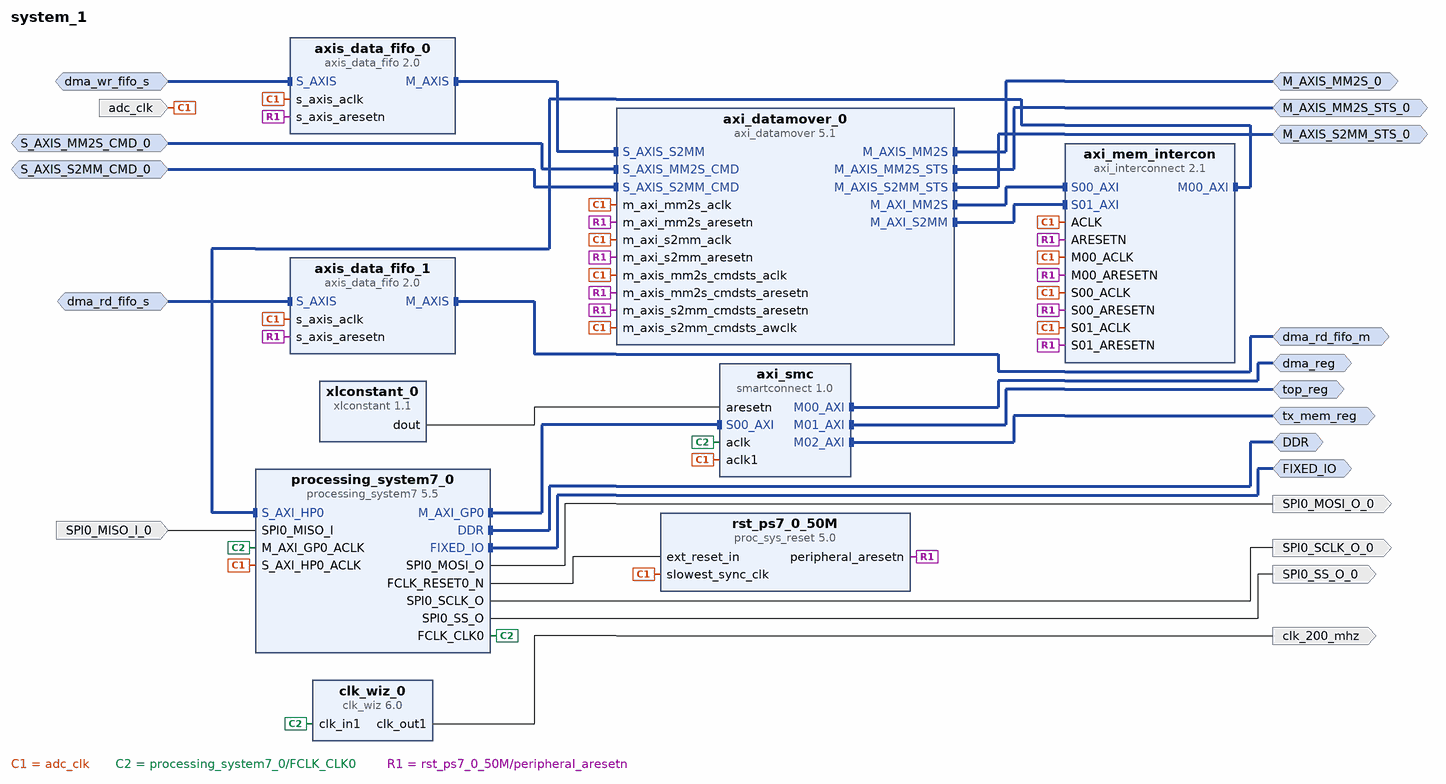
[diagram p0: block diagram of the top level]
# Vivado block design system_1, xc7z020clg400-2, Vivado 2024.2
create_bd_design system_1

create_bd_intf_port -mode Master -vlnv xilinx.com:interface:ddrx_rtl:1.0 DDR
create_bd_intf_port -mode Master -vlnv xilinx.com:display_processing_system7:fixedio_rtl:1.0 FIXED_IO
create_bd_intf_port -mode Slave -vlnv xilinx.com:interface:axis_rtl:1.0 S_AXIS_MM2S_CMD_0
set_property -dict [list \
  CONFIG.HAS_TKEEP 0 \
  CONFIG.HAS_TLAST 0 \
  CONFIG.HAS_TREADY 1 \
  CONFIG.HAS_TSTRB 0 \
  CONFIG.LAYERED_METADATA undef \
  CONFIG.TDATA_NUM_BYTES 9 \
  CONFIG.TDEST_WIDTH 0 \
  CONFIG.TID_WIDTH 0 \
  CONFIG.TUSER_WIDTH 0 \
] [get_bd_intf_ports S_AXIS_MM2S_CMD_0]
create_bd_intf_port -mode Slave -vlnv xilinx.com:interface:axis_rtl:1.0 S_AXIS_S2MM_CMD_0
set_property -dict [list \
  CONFIG.HAS_TKEEP 0 \
  CONFIG.HAS_TLAST 0 \
  CONFIG.HAS_TREADY 1 \
  CONFIG.HAS_TSTRB 0 \
  CONFIG.LAYERED_METADATA undef \
  CONFIG.TDATA_NUM_BYTES 9 \
  CONFIG.TDEST_WIDTH 0 \
  CONFIG.TID_WIDTH 0 \
  CONFIG.TUSER_WIDTH 0 \
] [get_bd_intf_ports S_AXIS_S2MM_CMD_0]
create_bd_intf_port -mode Slave -vlnv xilinx.com:interface:axis_rtl:1.0 dma_wr_fifo_s
set_property -dict [list \
  CONFIG.HAS_TKEEP 1 \
  CONFIG.HAS_TLAST 1 \
  CONFIG.HAS_TREADY 1 \
  CONFIG.HAS_TSTRB 0 \
  CONFIG.LAYERED_METADATA undef \
  CONFIG.TDATA_NUM_BYTES 8 \
  CONFIG.TDEST_WIDTH 0 \
  CONFIG.TID_WIDTH 0 \
  CONFIG.TUSER_WIDTH 0 \
] [get_bd_intf_ports dma_wr_fifo_s]
create_bd_intf_port -mode Master -vlnv xilinx.com:interface:axis_rtl:1.0 M_AXIS_MM2S_STS_0
create_bd_intf_port -mode Master -vlnv xilinx.com:interface:axis_rtl:1.0 M_AXIS_S2MM_STS_0
create_bd_intf_port -mode Master -vlnv xilinx.com:interface:axis_rtl:1.0 M_AXIS_MM2S_0
create_bd_intf_port -mode Master -vlnv xilinx.com:interface:aximm_rtl:1.0 dma_reg
set_property -dict [list \
  CONFIG.ADDR_WIDTH 32 \
  CONFIG.DATA_WIDTH 32 \
  CONFIG.HAS_BURST 0 \
  CONFIG.HAS_CACHE 0 \
  CONFIG.HAS_LOCK 0 \
  CONFIG.HAS_QOS 0 \
  CONFIG.HAS_REGION 0 \
  CONFIG.HAS_WSTRB 1 \
  CONFIG.PROTOCOL AXI4LITE \
] [get_bd_intf_ports dma_reg]
create_bd_intf_port -mode Master -vlnv xilinx.com:interface:aximm_rtl:1.0 top_reg
set_property -dict [list \
  CONFIG.ADDR_WIDTH 32 \
  CONFIG.DATA_WIDTH 32 \
  CONFIG.FREQ_HZ 122880000 \
  CONFIG.HAS_BURST 0 \
  CONFIG.HAS_CACHE 0 \
  CONFIG.HAS_LOCK 0 \
  CONFIG.HAS_QOS 0 \
  CONFIG.PROTOCOL AXI4LITE \
] [get_bd_intf_ports top_reg]
create_bd_intf_port -mode Master -vlnv xilinx.com:interface:aximm_rtl:1.0 tx_mem_reg
set_property -dict [list \
  CONFIG.ADDR_WIDTH 32 \
  CONFIG.DATA_WIDTH 32 \
  CONFIG.FREQ_HZ 122880000 \
  CONFIG.HAS_BURST 0 \
  CONFIG.HAS_CACHE 0 \
  CONFIG.HAS_LOCK 0 \
  CONFIG.HAS_QOS 0 \
  CONFIG.HAS_REGION 0 \
  CONFIG.PROTOCOL AXI4LITE \
] [get_bd_intf_ports tx_mem_reg]
create_bd_intf_port -mode Slave -vlnv xilinx.com:interface:axis_rtl:1.0 dma_rd_fifo_s
set_property -dict [list \
  CONFIG.FREQ_HZ 122880000 \
  CONFIG.HAS_TKEEP 1 \
  CONFIG.HAS_TLAST 1 \
  CONFIG.HAS_TREADY 1 \
  CONFIG.HAS_TSTRB 0 \
  CONFIG.LAYERED_METADATA undef \
  CONFIG.TDATA_NUM_BYTES 8 \
  CONFIG.TDEST_WIDTH 0 \
  CONFIG.TID_WIDTH 0 \
  CONFIG.TUSER_WIDTH 0 \
] [get_bd_intf_ports dma_rd_fifo_s]
create_bd_intf_port -mode Master -vlnv xilinx.com:interface:axis_rtl:1.0 dma_rd_fifo_m
set_property -dict {CONFIG.FREQ_HZ 122880000} [get_bd_intf_ports dma_rd_fifo_m]
create_bd_port -dir O SPI0_SCLK_O_0
create_bd_port -dir I SPI0_MISO_I_0
create_bd_port -dir O SPI0_MOSI_O_0
create_bd_port -dir O SPI0_SS_O_0
create_bd_port -dir I -type clk adc_clk
set_property -dict [list \
  CONFIG.ASSOCIATED_BUSIF S_AXIS_MM2S_CMD_0:S_AXIS_S2MM_CMD_0:dma_wr_fifo_s:M_AXIS_MM2S_STS_0:M_AXIS_S2MM_STS_0:M_AXIS_MM2S_0:dma_reg:top_reg:tx_mem_reg:dma_rd_fifo_m:dma_rd_fifo_s \
  CONFIG.FREQ_HZ 122880000 \
] [get_bd_ports adc_clk]
create_bd_port -dir O -type clk clk_200_mhz

create_bd_cell -type ip -vlnv xilinx.com:ip:processing_system7:5.5 processing_system7_0
set_property -dict [list \
  CONFIG.PCW_ENET0_ENET0_IO {MIO 16 .. 27} \
  CONFIG.PCW_ENET0_GRP_MDIO_ENABLE 1 \
  CONFIG.PCW_ENET0_GRP_MDIO_IO {MIO 52 .. 53} \
  CONFIG.PCW_ENET0_PERIPHERAL_ENABLE 1 \
  CONFIG.PCW_PRESET_BANK0_VOLTAGE {LVCMOS 1.8V} \
  CONFIG.PCW_PRESET_BANK1_VOLTAGE {LVCMOS 1.8V} \
  CONFIG.PCW_QSPI_GRP_SINGLE_SS_ENABLE 1 \
  CONFIG.PCW_QSPI_GRP_SINGLE_SS_IO {MIO 1 .. 6} \
  CONFIG.PCW_QSPI_PERIPHERAL_ENABLE 1 \
  CONFIG.PCW_QSPI_QSPI_IO {MIO 1 .. 6} \
  CONFIG.PCW_SD0_GRP_CD_ENABLE 0 \
  CONFIG.PCW_SD0_GRP_WP_ENABLE 0 \
  CONFIG.PCW_SD0_PERIPHERAL_ENABLE 1 \
  CONFIG.PCW_SD0_SD0_IO {MIO 40 .. 45} \
  CONFIG.PCW_SDIO_PERIPHERAL_FREQMHZ 100 \
  CONFIG.PCW_SINGLE_QSPI_DATA_MODE x4 \
  CONFIG.PCW_SPI0_PERIPHERAL_ENABLE 1 \
  CONFIG.PCW_SPI0_SPI0_IO EMIO \
  CONFIG.PCW_UART1_PERIPHERAL_ENABLE 1 \
  CONFIG.PCW_UART1_UART1_IO {MIO 8 .. 9} \
  CONFIG.PCW_UART_PERIPHERAL_FREQMHZ 100 \
  CONFIG.PCW_UIPARAM_DDR_PARTNO {MT41K256M16 RE-125} \
  CONFIG.PCW_USB0_PERIPHERAL_ENABLE 1 \
  CONFIG.PCW_USB0_USB0_IO {MIO 28 .. 39} \
  CONFIG.PCW_USE_S_AXI_HP0 1 \
] [get_bd_cells processing_system7_0]
# 167 more settings of processing_system7_0 are not shown: defaults, MIO pin electricals, DDR timing, and values the tool derives
create_bd_cell -type ip -vlnv xilinx.com:ip:smartconnect:1.0 axi_smc
set_property -dict {CONFIG.NUM_CLKS 2 CONFIG.NUM_MI 3 CONFIG.NUM_SI 1} [get_bd_cells axi_smc]
create_bd_cell -type ip -vlnv xilinx.com:ip:clk_wiz:6.0 clk_wiz_0
set_property -dict [list \
  CONFIG.CLKIN1_JITTER_PS 100.00 \
  CONFIG.CLKIN1_UI_JITTER 100.00 \
  CONFIG.CLKIN2_JITTER_PS 100.000 \
  CONFIG.CLKIN2_UI_JITTER 100.000 \
  CONFIG.CLKOUT1_DRIVES BUFG \
  CONFIG.CLKOUT1_JITTER 137.872 \
  CONFIG.CLKOUT1_REQUESTED_OUT_FREQ 200.000 \
  CONFIG.CLKOUT2_DRIVES BUFG \
  CONFIG.CLKOUT3_DRIVES BUFG \
  CONFIG.CLKOUT4_DRIVES BUFG \
  CONFIG.CLKOUT5_DRIVES BUFG \
  CONFIG.CLKOUT6_DRIVES BUFG \
  CONFIG.CLKOUT7_DRIVES BUFG \
  CONFIG.JITTER_OPTIONS PS \
  CONFIG.MMCM_CLKOUT0_DIVIDE_F 5.000 \
  CONFIG.MMCM_REF_JITTER1 0.005 \
  CONFIG.MMCM_REF_JITTER2 0.010 \
  CONFIG.PRIM_SOURCE No_buffer \
  CONFIG.SECONDARY_SOURCE Single_ended_clock_capable_pin \
  CONFIG.USE_FREQ_SYNTH true \
  CONFIG.USE_LOCKED false \
  CONFIG.USE_PHASE_ALIGNMENT true \
  CONFIG.USE_RESET false \
] [get_bd_cells clk_wiz_0]
create_bd_cell -type ip -vlnv xilinx.com:ip:xlconstant:1.1 xlconstant_0
create_bd_cell -type ip -vlnv xilinx.com:ip:axi_datamover:5.1 axi_datamover_0
set_property -dict [list \
  CONFIG.c_dummy 1 \
  CONFIG.c_m_axi_s2mm_data_width 64 \
  CONFIG.c_m_axis_mm2s_tdata_width 64 \
  CONFIG.c_mm2s_btt_used 19 \
  CONFIG.c_mm2s_burst_size 256 \
  CONFIG.c_s2mm_btt_used 19 \
  CONFIG.c_s2mm_burst_size 256 \
  CONFIG.c_s_axis_s2mm_tdata_width 64 \
] [get_bd_cells axi_datamover_0]
create_bd_cell -type ip -vlnv xilinx.com:ip:axi_interconnect:2.1 axi_mem_intercon
set_property -dict {CONFIG.NUM_MI 1 CONFIG.NUM_SI 2} [get_bd_cells axi_mem_intercon]
create_bd_cell -type ip -vlnv xilinx.com:ip:proc_sys_reset:5.0 rst_ps7_0_50M
create_bd_cell -type ip -vlnv xilinx.com:ip:axis_data_fifo:2.0 axis_data_fifo_0
create_bd_cell -type ip -vlnv xilinx.com:ip:axis_data_fifo:2.0 axis_data_fifo_1

# ---- connections ----

connect_bd_intf_net -intf_net S_AXIS_0_1 [get_bd_intf_ports dma_rd_fifo_s] [get_bd_intf_pins axis_data_fifo_1/S_AXIS]
connect_bd_intf_net -intf_net S_AXIS_MM2S_CMD_0_1 [get_bd_intf_ports S_AXIS_MM2S_CMD_0] [get_bd_intf_pins axi_datamover_0/S_AXIS_MM2S_CMD]
connect_bd_intf_net -intf_net S_AXIS_S2MM_0_1 [get_bd_intf_ports dma_wr_fifo_s] [get_bd_intf_pins axis_data_fifo_0/S_AXIS]
connect_bd_intf_net -intf_net S_AXIS_S2MM_CMD_0_1 [get_bd_intf_ports S_AXIS_S2MM_CMD_0] [get_bd_intf_pins axi_datamover_0/S_AXIS_S2MM_CMD]
connect_bd_intf_net [get_bd_intf_ports M_AXIS_MM2S_0] [get_bd_intf_pins axi_datamover_0/M_AXIS_MM2S]
connect_bd_intf_net [get_bd_intf_ports M_AXIS_MM2S_STS_0] [get_bd_intf_pins axi_datamover_0/M_AXIS_MM2S_STS]
connect_bd_intf_net [get_bd_intf_ports M_AXIS_S2MM_STS_0] [get_bd_intf_pins axi_datamover_0/M_AXIS_S2MM_STS]
connect_bd_intf_net [get_bd_intf_pins axi_datamover_0/M_AXI_MM2S] [get_bd_intf_pins axi_mem_intercon/S00_AXI]
connect_bd_intf_net [get_bd_intf_pins axi_datamover_0/M_AXI_S2MM] [get_bd_intf_pins axi_mem_intercon/S01_AXI]
connect_bd_intf_net [get_bd_intf_pins axi_mem_intercon/M00_AXI] [get_bd_intf_pins processing_system7_0/S_AXI_HP0]
connect_bd_intf_net [get_bd_intf_ports dma_reg] [get_bd_intf_pins axi_smc/M00_AXI]
connect_bd_intf_net [get_bd_intf_ports top_reg] [get_bd_intf_pins axi_smc/M01_AXI]
connect_bd_intf_net [get_bd_intf_ports tx_mem_reg] [get_bd_intf_pins axi_smc/M02_AXI]
connect_bd_intf_net [get_bd_intf_pins axis_data_fifo_0/M_AXIS] [get_bd_intf_pins axi_datamover_0/S_AXIS_S2MM]
connect_bd_intf_net [get_bd_intf_ports dma_rd_fifo_m] [get_bd_intf_pins axis_data_fifo_1/M_AXIS]
connect_bd_intf_net [get_bd_intf_ports DDR] [get_bd_intf_pins processing_system7_0/DDR]
connect_bd_intf_net [get_bd_intf_ports FIXED_IO] [get_bd_intf_pins processing_system7_0/FIXED_IO]
connect_bd_intf_net [get_bd_intf_pins processing_system7_0/M_AXI_GP0] [get_bd_intf_pins axi_smc/S00_AXI]
connect_bd_net -net SPI0_MISO_I_0_1 [get_bd_ports SPI0_MISO_I_0] [get_bd_pins processing_system7_0/SPI0_MISO_I]
connect_bd_net -net axi_ad9361_0_l_clk [get_bd_ports adc_clk] \
  [get_bd_pins axi_mem_intercon/S01_ACLK] [get_bd_pins axi_mem_intercon/M00_ACLK] [get_bd_pins axi_mem_intercon/S00_ACLK] \
  [get_bd_pins axi_mem_intercon/ACLK] [get_bd_pins processing_system7_0/S_AXI_HP0_ACLK] \
  [get_bd_pins axi_datamover_0/m_axi_mm2s_aclk] [get_bd_pins axi_datamover_0/m_axis_mm2s_cmdsts_aclk] \
  [get_bd_pins axi_datamover_0/m_axi_s2mm_aclk] [get_bd_pins axi_datamover_0/m_axis_s2mm_cmdsts_awclk] \
  [get_bd_pins rst_ps7_0_50M/slowest_sync_clk] [get_bd_pins axi_smc/aclk1] [get_bd_pins axis_data_fifo_0/s_axis_aclk] \
  [get_bd_pins axis_data_fifo_1/s_axis_aclk]
connect_bd_net [get_bd_pins clk_wiz_0/clk_out1] [get_bd_ports clk_200_mhz]
connect_bd_net [get_bd_pins processing_system7_0/FCLK_CLK0] \
  [get_bd_pins processing_system7_0/M_AXI_GP0_ACLK] [get_bd_pins axi_smc/aclk] [get_bd_pins clk_wiz_0/clk_in1]
connect_bd_net [get_bd_pins processing_system7_0/FCLK_RESET0_N] [get_bd_pins rst_ps7_0_50M/ext_reset_in]
connect_bd_net [get_bd_pins processing_system7_0/SPI0_MOSI_O] [get_bd_ports SPI0_MOSI_O_0]
connect_bd_net [get_bd_pins processing_system7_0/SPI0_SCLK_O] [get_bd_ports SPI0_SCLK_O_0]
connect_bd_net [get_bd_pins processing_system7_0/SPI0_SS_O] [get_bd_ports SPI0_SS_O_0]
connect_bd_net -net rst_ps7_0_50M_peripheral_aresetn [get_bd_pins xlconstant_0/dout] [get_bd_pins axi_smc/aresetn]
connect_bd_net [get_bd_pins rst_ps7_0_50M/peripheral_aresetn] \
  [get_bd_pins axi_datamover_0/m_axi_mm2s_aresetn] [get_bd_pins axi_mem_intercon/S00_ARESETN] \
  [get_bd_pins axi_mem_intercon/M00_ARESETN] [get_bd_pins axi_mem_intercon/ARESETN] \
  [get_bd_pins axi_mem_intercon/S01_ARESETN] [get_bd_pins axi_datamover_0/m_axis_mm2s_cmdsts_aresetn] \
  [get_bd_pins axi_datamover_0/m_axi_s2mm_aresetn] [get_bd_pins axi_datamover_0/m_axis_s2mm_cmdsts_aresetn] \
  [get_bd_pins axis_data_fifo_0/s_axis_aresetn] [get_bd_pins axis_data_fifo_1/s_axis_aresetn]

# ---- address map ----
assign_bd_address -offset 0x00000000 -range 1G -target_address_space [get_bd_addr_spaces axi_datamover_0/Data_MM2S] [get_bd_addr_segs processing_system7_0/S_AXI_HP0/HP0_DDR_LOWOCM]
assign_bd_address -offset 0x00000000 -range 1G -target_address_space [get_bd_addr_spaces axi_datamover_0/Data_S2MM] [get_bd_addr_segs processing_system7_0/S_AXI_HP0/HP0_DDR_LOWOCM]
assign_bd_address -offset 0x43C00000 -range 64K -target_address_space [get_bd_addr_spaces processing_system7_0/Data] [get_bd_addr_segs tx_mem_reg/Reg]
assign_bd_address -offset 0x43C10000 -range 64K -target_address_space [get_bd_addr_spaces processing_system7_0/Data] [get_bd_addr_segs dma_reg/Reg]
assign_bd_address -offset 0x43C20000 -range 64K -target_address_space [get_bd_addr_spaces processing_system7_0/Data] [get_bd_addr_segs top_reg/Reg]

validate_bd_design
save_bd_design
